# Altium schematic sheet MPPT charger.SchDoc
size A4
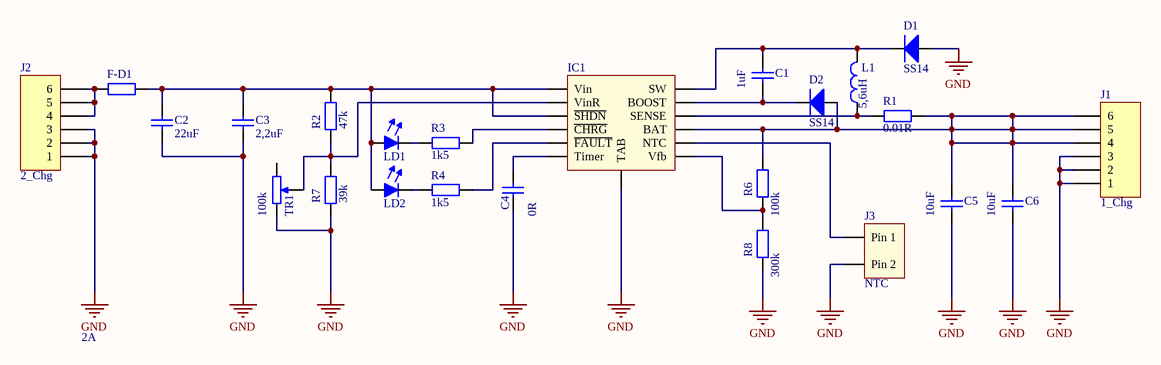
[diagram p0: MPPT charger.SchDoc]

## Parts
C1  value 1uF  [0805 CAP]  (hidden comment: Capacitor)
C2  value 22uF  [2512 CAP]  (hidden comment: Capacitor)
C3  value 2,2uF  [1206 CAP]  (hidden comment: Capacitor)
C4  value 0R  [0603 cap]  (hidden comment: Capacitor/Bridge)
C5  value 10uF  [0805 CAP]  (hidden comment: Capacitor)
C6  value 10uF  [1812 CAP]  (hidden comment: Capacitor)
D1  SS14  [SMB]
D2  SS14  [SMB]
F-D1  value 2A  [1206 RES]  (hidden comment: Resistor generic)
IC1  LTC3652  [MSOP12 - EP]  (value not drawn)
J1  1_Chg  [HDR1X6]
J2  2_Chg  [HDR1X6]
J3  NTC  [HDR1X2]
L1  value 5,6uH  [FDSD0420-H]  (hidden comment: Inductor)
LD1  LED diode  [LED_0603]  (value not drawn)
LD2  LED diode  [LED_0603]  (value not drawn)
R1  value 0.01R  [1812 RES]  (hidden comment: Resistor generic)
R2  value 47k  [0603 RES]  (hidden comment: Resistor generic)
R3  value 1k5  [0603 RES]  (hidden comment: Resistor generic)
R4  value 1k5  [0603 RES]  (hidden comment: Resistor generic)
R6  value 100k  [0603 RES]  (hidden comment: FB1)
R7  value 39k  [0603 RES]  (hidden comment: Resistor generic)
R8  value 300k  [0603 RES]  (hidden comment: FB2)
TR1  value 100k  [Multiturn 1]  (hidden comment: Resistor_trim)

## Nets
GND: C2.1 C3.1 C4.1 C5.1 C6.1 D1.1(A) IC1.13(TAB) J1.1 J1.2 J1.3 J2.1 J2.2 J2.3 J3.2(Pin_2) R7.1 R8.1 TR1.2(BOT)
NetC1_1: C1.1 D2.2(K) IC1.11(BOOST)
NetC1_2: C1.2 D1.2(K) IC1.12(SW) L1.2
NetC2_2: C2.2 C3.2 F-D1.2 IC1.1(Vin) IC1.3(~{SHDN}) LD1.1(A1) LD2.1(A1) R2.2
NetC4_2: C4.2 IC1.6(Timer)
NetC5_2: C5.2 C6.2 D2.1(A) IC1.9(BAT) J1.4 J1.5 J1.6 R1.1 R6.2
NetF-D1_1: F-D1.1 J2.4 J2.5 J2.6
NetIC1_2: IC1.2(VinR) R2.1 R7.2 TR1.3(TAP)
NetIC1_4: IC1.4(~{CHRG}) R3.2
NetIC1_5: IC1.5(~{FAULT}) R4.2
NetIC1_7: IC1.7(Vfb) R6.1 R8.2
NetIC1_8: IC1.8(NTC) J3.1(Pin_1)
NetIC1_10: IC1.10(SENSE) L1.1 R1.2
NetLD1_2: LD1.2(K) R3.1
NetLD2_2: LD2.2(K) R4.1

Not connected (* = marked no-connect by the designer): TR1 1(TOP)

## Library data of the parts
C1-C3 = Capacitor NP: Voltage: 35V
C4 = Capacitor NP: Desc: Cap or Res 0R; Voltage: *
C5 C6 = Capacitor NP: Voltage: 6V
D1 D2 = Diode 1N4148: High Conductance Fast Diode; Value: SS14
F-D1 R1-R4 R6-R8 = Resistor: Resistor SMD
J1 J2 = Header 6: Header, 6-Pin; LatestRevisionDate: 17-Jul-2002; LatestRevisionNote: Re-released for DXP Platform.; Publisher: Altium Limited
J3 = Pin Header 2: Beta: 3380; Value: 10k
L1 = Inductor: Single coil; Current: >4A; Supplier 1: Farnell; Supplier Part Number 1: 2530091
LD1 = LED diode: LED; Value: Red
LD2 = LED diode: LED; Value: Amber
TR1 = Resistor_trim: Trimmer
IC1 = LTC3652: Value: LTC3652